# EAGLE design gizmo (EAGLE 8.5.0)
COMPANY: ADAFRUIT INDUSTRIES; DRAWN: KTOWN; REV: B
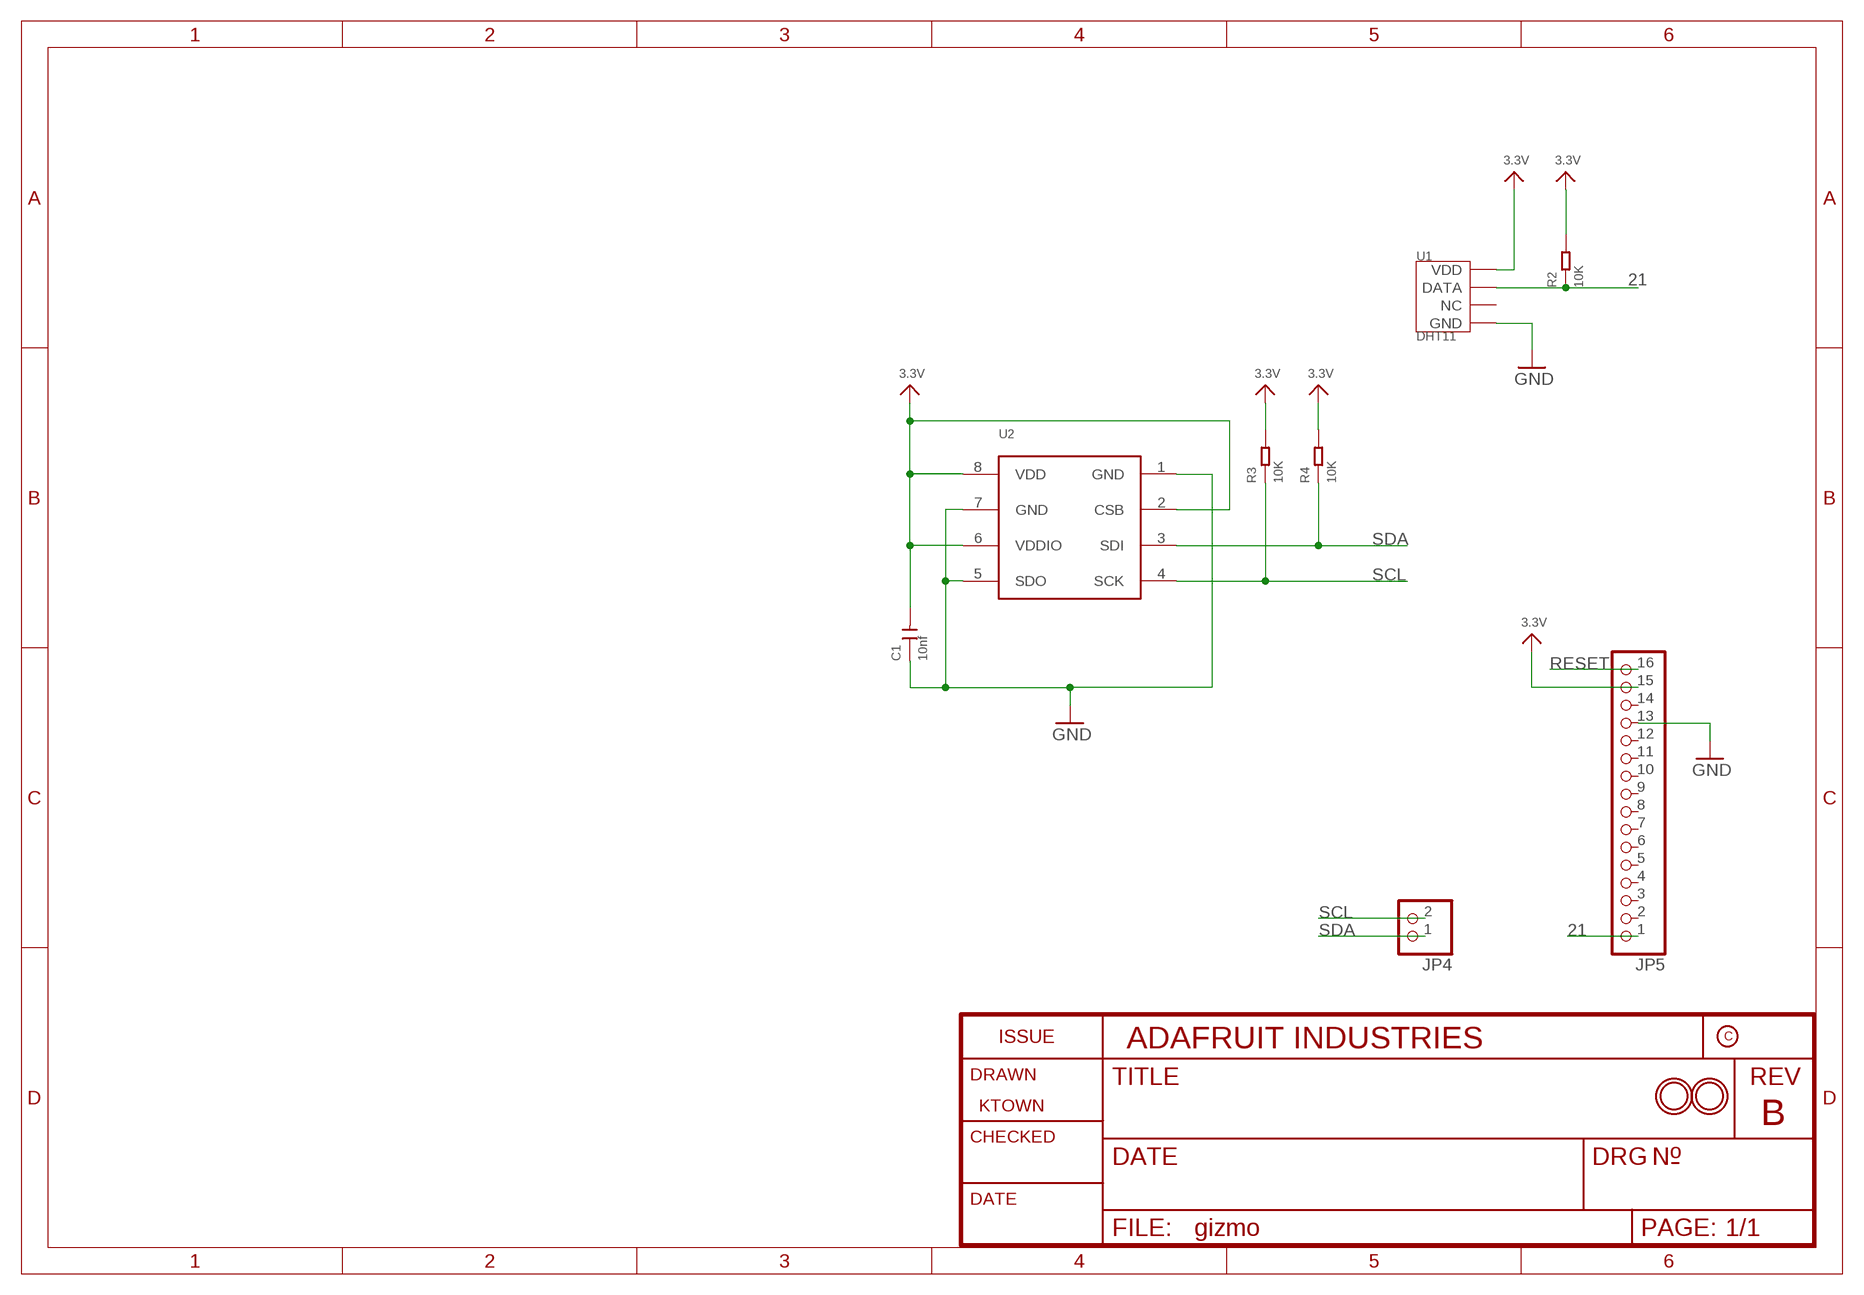
[diagram p0: schematic, sheet 1]

## Parts
C1  10nf  CERAMIC-10NF-50V-5%-X7R(0805)  [C0805]
JP4  PINHD-1X2  [1X02]
JP5  PINHD-1X16  [1X16]
R2  10K  SMD-RES-10K-1%-1/10W(0603)  [R0603]
R3  10K  SMD-RES-10K-1%-1/10W(0603)  [R0603]
R4  10K  SMD-RES-10K-1%-1/10W(0603)  [R0603]
U1  DHT11  TEM-HUM-DHT11(4P-15.5X12.0MM)  [SNR4-2.54-15.5X12.0X5.5MM]
U2  BMP280  [BMP280]
U$31  MOUNTINGHOLE2.5  [MOUNTINGHOLE_2.5_PLATED]
U$32  MOUNTINGHOLE2.5  [MOUNTINGHOLE_2.5_PLATED]

## Nets
3.3V: C1.2 JP5.15 R2.2 R3.2 R4.2 U1.1(VDD) U2.2(CSB) U2.6(VDDIO) U2.8(VDD)
21: JP5.1 R2.1 U1.2(DATA)
GND: C1.1 JP5.13 U1.4(GND) U2.1(GND) U2.5(SDO) U2.7(GND)
RESET: JP5.16
SCL: JP4.2 R3.1 U2.4(SCK)
SDA: JP4.1 R4.1 U2.3(SDI)
Unconnected: JP5.2 JP5.3 JP5.4 JP5.5 JP5.6 JP5.7 JP5.8 JP5.9 JP5.10 JP5.11 JP5.12 JP5.14 U1.3(NC)

## Notes on the sheet
- 21
- SDA
- SCL
- RESET
- SCL
- SDA | 21

## Library data of the parts
C1 = Seeed-Capacitor:CERAMIC-10NF-50V-5%-X7R(0805): 302010175; MPN: CC0805JRX7R9BB103
JP4 = mypinheads:PINHD-1X2: PIN HEADER
JP5 = mypinheads:PINHD-1X16: PIN HEADER
R2-R4 = Seeed-Resistor:SMD-RES-10K-1%-1/10W(0603): 301010299; MPN: RC0603FR-0710KL
U1 = Seeed-Sensor:TEM-HUM-DHT11(4P-15.5X12.0MM): 314010000; MPN: DHT11
U2 = Seeed-OPL-2017-01-Sensor-camilo:BMP280: 314030010
U$31 U$32 = microbuilder:MOUNTINGHOLE: Mounting Hole For #2 screws (0.086"/2.18mm width, 0.094"/2.4mm hole) use 2.5mm; BOM: EXCLUDE

## Board
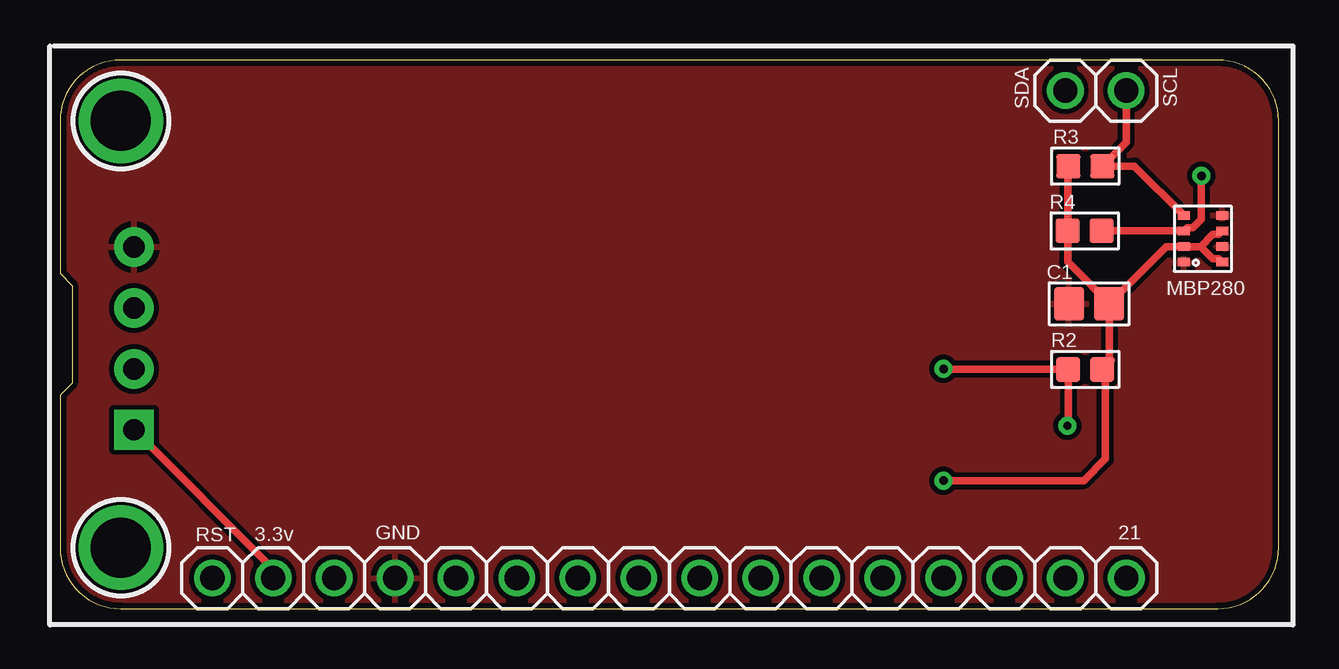
[diagram p1: board, top side]
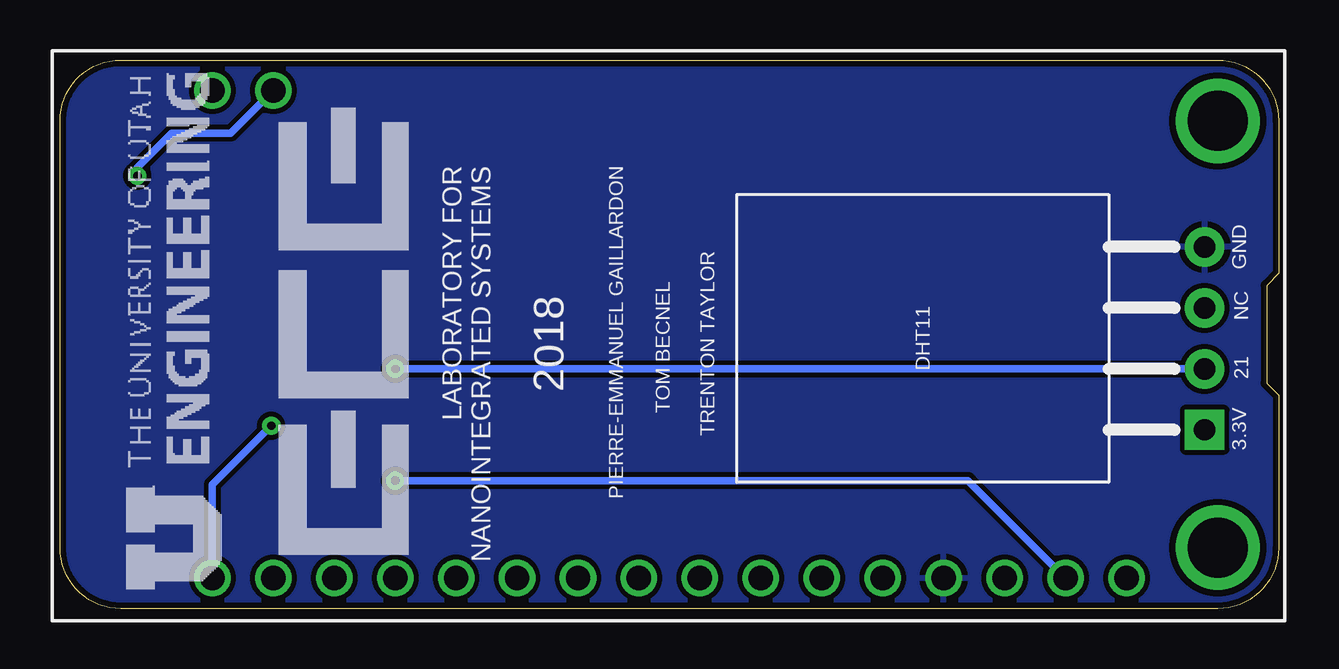
[diagram p2: board, bottom side, seen from below]

Size 50.8 x 22.86 mm. Coordinates in mm from the lower left corner, seen from the top.
Outline: 2.54,0 48.26,0 arc90 50.8,2.54 50.8,20.32 arc90 48.26,22.86 2.54,22.86 arc90 0,20.32 0,13.97 0.51,13.46 0.51,9.4 0,8.89 0,2.54 arc90 2.54,0
Copper layers (1*16): Top 0.035mm / dielectric 1.5mm / Bottom 0.035mm
Design rules "adafruit 7-7 *": minimum track width 6mil, minimum drill 15.5mil, track to track 8mil, track to pad 7mil, pad to pad 7mil, via to via 7mil, smd to smd 7mil, copper to edge 10mil, drill to drill 8mil, minimum pad ring 10mil, minimum via ring 8mil, stop-mask expansion 2mil, vias tented up to drill 20mil, thermal gap 10mil

### Footprints (pad centres in the part's own frame; a part is rotated, then mirrored left to right if it is on the bottom)
C0805 = smd 1.397 x 1.27: 1 0,0.835; 2 0,-0.835
1X02 = drill 1.016: 1 -1.27,0; 2 1.27,0
1X16 = drill 1.016: 1 -19.05,0; 2 -16.51,0; 3 -13.97,0; 4 -11.43,0; 5 -8.89,0; 6 -6.35,0; 7 -3.81,0; 8 -1.27,0; 9 1.27,0; 10 3.81,0; 11 6.35,0; 12 8.89,0; 13 11.43,0; 14 13.97,0; 15 16.51,0; 16 19.05,0
R0603 = smd 1.016 x 1.016: 1 0,0.708; 2 0,-0.708
SNR4-2.54-15.5X12.0X5.5MM = drill 0.889 pad 1.651 square: 1 -11.75,3.81 | drill 0.889 pad 1.651: 2 -11.75,1.27; 3 -11.75,-1.27; 4 -11.75,-3.81
BMP280 = smd 0.5 x 0.35: 1 0.8,0.975; 2 0.8,0.325; 3 0.8,-0.325; 4 0.8,-0.975; 5 -0.8,-0.975; 6 -0.8,-0.325; 7 -0.8,0.325; 8 -0.8,0.975
MOUNTINGHOLE_2.5_PLATED = drill 2.5 pad 3.2: P$1 0,0

### Placement (x,y rotation side)
C1  42.9,12.7 90 top
JP4  43.18,21.59 0 top
JP5  25.4,1.27 180 top
R2  42.73,9.97 90 top
R3  42.74,18.44 270 top
R4  42.71,15.74 270 top
U1  14.84,11.26 180 bottom
U2  47.64,15.41 180 top
U$31  2.54,20.32 270 top
U$32  2.54,2.54 270 top

### Tracks (layer width: path | path; a pad name or v marks a point on that pad's centre or on a via)
3.3V  (via drill 0.35)
  Top 0.305: U1.1 8.89,1.65 JP5.15 | R3.2 42,18.41 R4.2 42,14.46 43.03,13.44 43.03,13.4 C1.2 | U2.6 48.3,15.59 48.05,15.59 47.55,15.09 | U2.8 48.3,14.58 48.05,14.58 47.55,15.09 | 47.55,15.09 U2.2 46.12,15.09 C1.2 | 43.82,10.34 43.57,10.1 | 43.57,10.1 R2.2 43.73,10.26 C1.2 | v36.83,5.33 42.67,5.33 43.57,6.24 43.57,10.1
  Bottom 0.305: JP5.15 12.95,5.33 v36.83,5.33
21  (via drill 0.35)
  Top 0.305: v36.83,9.99 36.85,9.97 R2.1 42.02,7.65 v41.99,7.62
  Bottom 0.305: v36.83,9.99 U1.2 | v41.99,7.62 44.45,5.16 JP5.1
GND
  pour Top: 0,22.86 0,0 50.8,0 50.8,22.86
  pour Bottom: 0,0 50.8,0 50.8,22.86 0,22.86
SCL
  Top 0.305: JP4.2 44.45,19.44 R3.1 44.79,18.43 U2.4
SDA  (via drill 0.35)
  Top 0.305: R4.1 U2.3 46.98,15.88 47.22,15.88 47.58,16.23 v47.58,18.03
  Bottom 0.305: JP4.1 43.68,19.81 46.14,19.81 47.58,18.37 v47.58,18.03

### Text on the board
tPlace: SDA | SCL | R3 | R4 | C1 | MBP280 | R2 | RST | 3.3v | GND | 21
bPlace: PIERRE-EMMANUEL GAILLARDON | LABORATORY FOR / NANOINTEGRATED SYSTEMS | TRENTON TAYLOR | GND | TOM BECNEL | DHT11 | 2018 | NC | 21 | 3.3V